# Altium schematic sheet cpu2_lock.SchDoc
size A3; DocumentNumber: 6; Revision: V1.0; SheetNumber: 6; SheetTotal: 9; Rule: PcbType=ProtelPcb
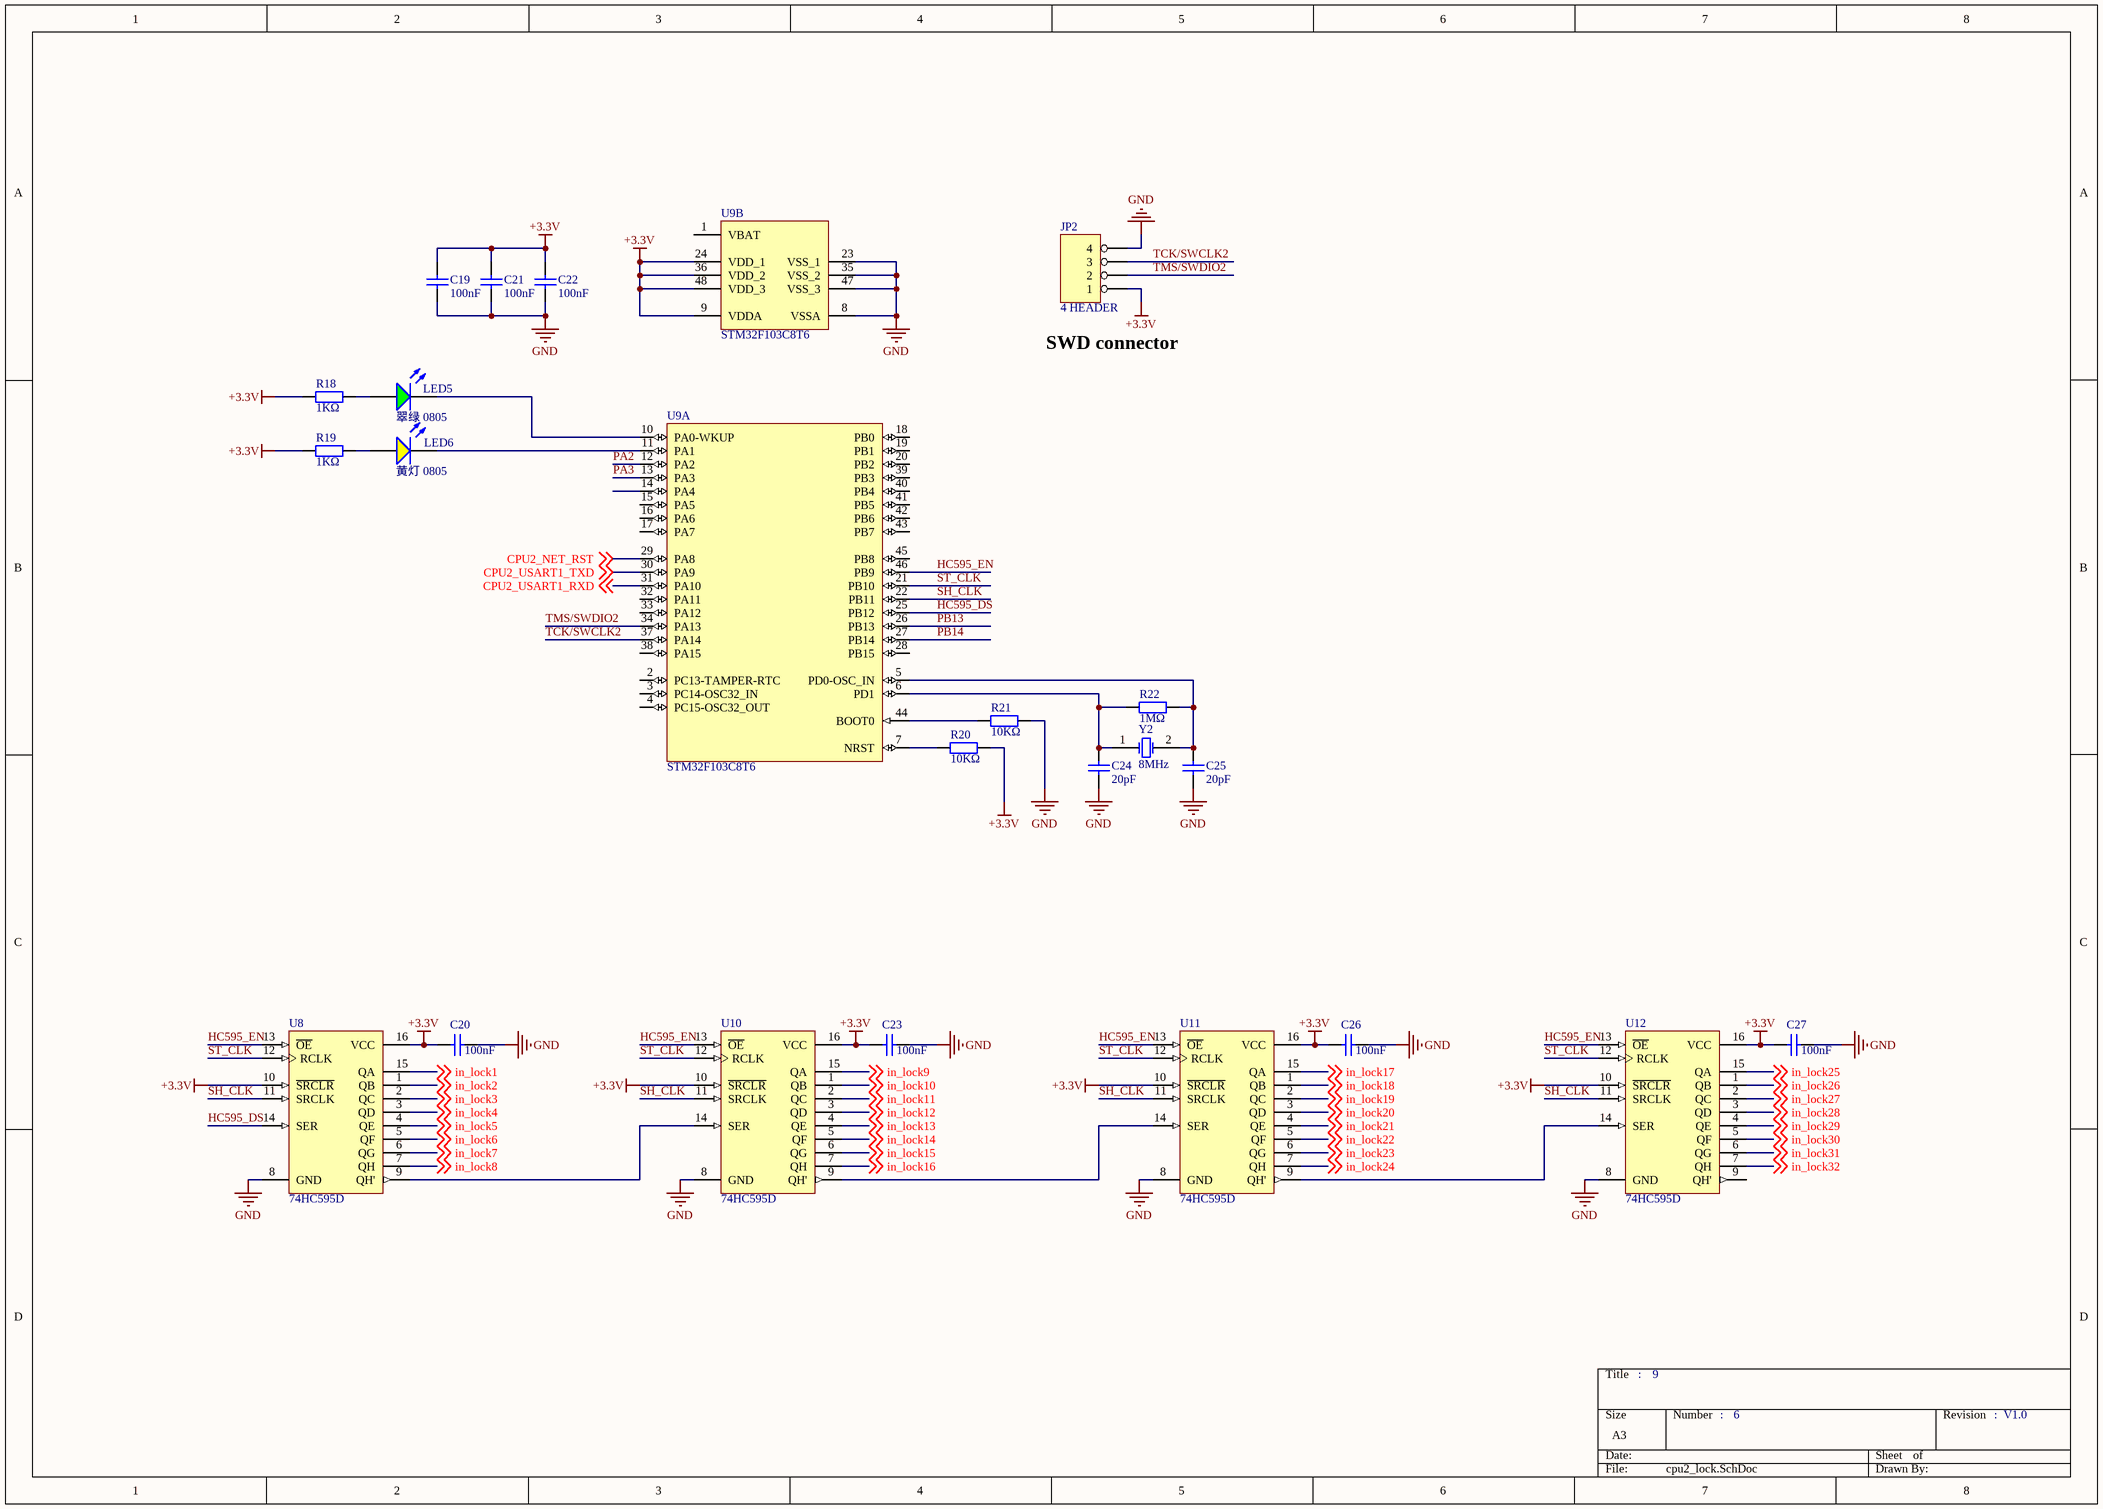
[diagram p0: cpu2_lock.SchDoc]

## Parts
C19  100nF  [0805_C]
C20  100nF  [0805_C]
C21  100nF  [0805_C]
C22  100nF  [0805_C]
C23  100nF  [0805_C]
C24  20pF  [0805_C]
C25  20pF  [0805_C]
C26  100nF  [0805_C]
C27  100nF  [0805_C]
JP2  4 HEADER  [CON4_1.5]
LED5  翠绿 0805  [0805_LED_S1]
LED6  黄灯 0805  [0805_LED_S1]
R18  1KΩ  [0805_R]
R19  1KΩ  [0805_R]
R20  10KΩ  [0805_R]
R21  10KΩ  [0805_R]
R22  1MΩ  [0805_R]
U8  74HC595D  [SOIC-16_150mil]
U9  STM32F103C8T6  [LQFP-48_7x7x05P]  (parts A,B of 2)
U10  74HC595D  [SOIC-16_150mil]
U11  74HC595D  [SOIC-16_150mil]
U12  74HC595D  [SOIC-16_150mil]
Y2  8MHz  [XTAL_US1]

## Nets
+3.3V: C19.2 C20.2 C21.2 C22.2 C23.2 C26.2 C27.2 JP2.1 R18.1 R19.1 R20.1 U8.10(~{SRCLR}) U8.16(VCC) U9.9(VDDA) U9.24(VDD_1) U9.36(VDD_2) U9.48(VDD_3) U10.10(~{SRCLR}) U10.16(VCC) U11.10(~{SRCLR}) U11.16(VCC) U12.10(~{SRCLR}) U12.16(VCC)
GND: C19.1 C20.1 C21.1 C22.1 C23.1 C24.1 C25.1 C26.1 C27.1 JP2.4 R21.1 U8.8(GND) U9.8(VSSA) U9.23(VSS_1) U9.35(VSS_2) U9.47(VSS_3) U10.8(GND) U11.8(GND) U12.8(GND)
CPU2_NET_RST: U9.29(PA8) ; off-sheet CPU2_NET_RST
CPU2_USART1_RXD: U9.31(PA10) ; off-sheet CPU2_USART1_RXD
CPU2_USART1_TXD: U9.30(PA9) ; off-sheet CPU2_USART1_TXD
HC595_DS: U8.14(SER) U9.25(PB12)
HC595_EN: U8.13(~{OE}) U9.46(PB9) U10.13(~{OE}) U11.13(~{OE}) U12.13(~{OE})
in_lock1: U8.15(QA) ; off-sheet in_lock1
in_lock2: U8.1(QB) ; off-sheet in_lock2
in_lock3: U8.2(QC) ; off-sheet in_lock3
in_lock4: U8.3(QD) ; off-sheet in_lock4
in_lock5: U8.4(QE) ; off-sheet in_lock5
in_lock6: U8.5(QF) ; off-sheet in_lock6
in_lock7: U8.6(QG) ; off-sheet in_lock7
in_lock8: U8.7(QH) ; off-sheet in_lock8
in_lock9: U10.15(QA) ; off-sheet in_lock9
in_lock10: U10.1(QB) ; off-sheet in_lock10
in_lock11: U10.2(QC) ; off-sheet in_lock11
in_lock12: U10.3(QD) ; off-sheet in_lock12
in_lock13: U10.4(QE) ; off-sheet in_lock13
in_lock14: U10.5(QF) ; off-sheet in_lock14
in_lock15: U10.6(QG) ; off-sheet in_lock15
in_lock16: U10.7(QH) ; off-sheet in_lock16
in_lock17: U11.15(QA) ; off-sheet in_lock17
in_lock18: U11.1(QB) ; off-sheet in_lock18
in_lock19: U11.2(QC) ; off-sheet in_lock19
in_lock20: U11.3(QD) ; off-sheet in_lock20
in_lock21: U11.4(QE) ; off-sheet in_lock21
in_lock22: U11.5(QF) ; off-sheet in_lock22
in_lock23: U11.6(QG) ; off-sheet in_lock23
in_lock24: U11.7(QH) ; off-sheet in_lock24
in_lock25: U12.15(QA) ; off-sheet in_lock25
in_lock26: U12.1(QB) ; off-sheet in_lock26
in_lock27: U12.2(QC) ; off-sheet in_lock27
in_lock28: U12.3(QD) ; off-sheet in_lock28
in_lock29: U12.4(QE) ; off-sheet in_lock29
in_lock30: U12.5(QF) ; off-sheet in_lock30
in_lock31: U12.6(QG) ; off-sheet in_lock31
in_lock32: U12.7(QH) ; off-sheet in_lock32
PA2: U9.12(PA2)
PA3: U9.13(PA3)
PB13: U9.26(PB13)
PB14: U9.27(PB14)
SH_CLK: U8.11(SRCLK) U9.22(PB11) U10.11(SRCLK) U11.11(SRCLK) U12.11(SRCLK)
ST_CLK: U8.12(RCLK) U9.21(PB10) U10.12(RCLK) U11.12(RCLK) U12.12(RCLK)
TCK/SWCLK2: JP2.3 U9.37(PA14)
TMS/SWDIO2: JP2.2 U9.34(PA13)
NetC24_2: C24.2 R22.2 U9.6(PD1) Y2.1(OSC1)
NetC25_2: C25.2 R22.1 U9.5(PD0-OSC_IN) Y2.2(OSC2)
NetLED5_A: LED5.A R18.2
NetLED5_K: LED5.K U9.10(PA0-WKUP)
NetLED6_A: LED6.A R19.2
NetLED6_K: LED6.K U9.11(PA1)
NetR20_2: R20.2 U9.7(NRST)
NetR21_2: R21.2 U9.44(BOOT0)
NetU8_9: U8.9(QH') U10.14(SER)
NetU10_9: U10.9(QH') U11.14(SER)
NetU11_9: U11.9(QH') U12.14(SER)

Not connected (* = marked no-connect by the designer): U9 1(VBAT) 2(PC13-TAMPER-RTC) 3(PC14-OSC32_IN) 4(PC15-OSC32_OUT) 14(PA4) 15(PA5) 16(PA6) 17(PA7) 18(PB0) 19(PB1) 20(PB2) 28(PB15) 32(PA11) 33(PA12) 38(PA15) 39(PB3) 40(PB4) 41(PB5) 42(PB6) 43(PB7) 45(PB8); U12 9(QH')

## Notes on the sheet
- (near JP2) SWD connector
- :

## Library data of the parts
C19-C27 = 0805 100nF(104) 10% 50V: 贴片电容; ComponentLink1Description: 供应商链接; ComponentLink1URL: http://www.szlcsc.com/product/details_50686.html; Package: 0805; Supplier: LC; SuppliersPartNumber: C49678
JP2 = 4 HEADER: 4 Pin Header
LED5 = 0805 翠绿: 发光二极管; ComponentLink1Description: 供应商链接; ComponentLink1URL: http://www.szlcsc.com/product/details_2670.html; Package: 0805; Supplier: LC; SuppliersPartNumber: C2297
LED6 = 0805 黄灯: 发光二极管; ComponentLink1Description: 供应商链接; ComponentLink1URL: http://www.szlcsc.com/product/details_2669.html; Package: 0805; Supplier: LC; SuppliersPartNumber: C2296
R18-R22 = 0805 11KΩ (1102) 1%: 贴片电阻; ComponentLink1Description: 供应商链接; ComponentLink1URL: http://www.szlcsc.com/product/details_18117.html; Package: 0805; Supplier: LC; SuppliersPartNumber: C17429
U8 U10-U12 = 74HC595D: 74系列逻辑芯片; ComponentLink1Description: 供应商链接; ComponentLink1URL: http://www.szlcsc.com/product/details_6413.html; Package: SOIC-16_150mil; Supplier: LC; SuppliersPartNumber: C5947
U9 = STM32F103C8T6: ARM; ComponentLink1Description: 供应商链接; ComponentLink1URL: http://www.szlcsc.com/product/details_9243.html; Package: LQFP-48_7x7x05P; Supplier: LC; SuppliersPartNumber: C8734
Y2 = XTAL: Crystal Oscillator; Published: 8-Jun-2000; LatestRevisionDate: 17-Jul-2002; LatestRevisionNote: Re-released for DXP Platform.; Publisher: Altium Limited